# EAGLE design PiezoMini (EAGLE 7.5.0)
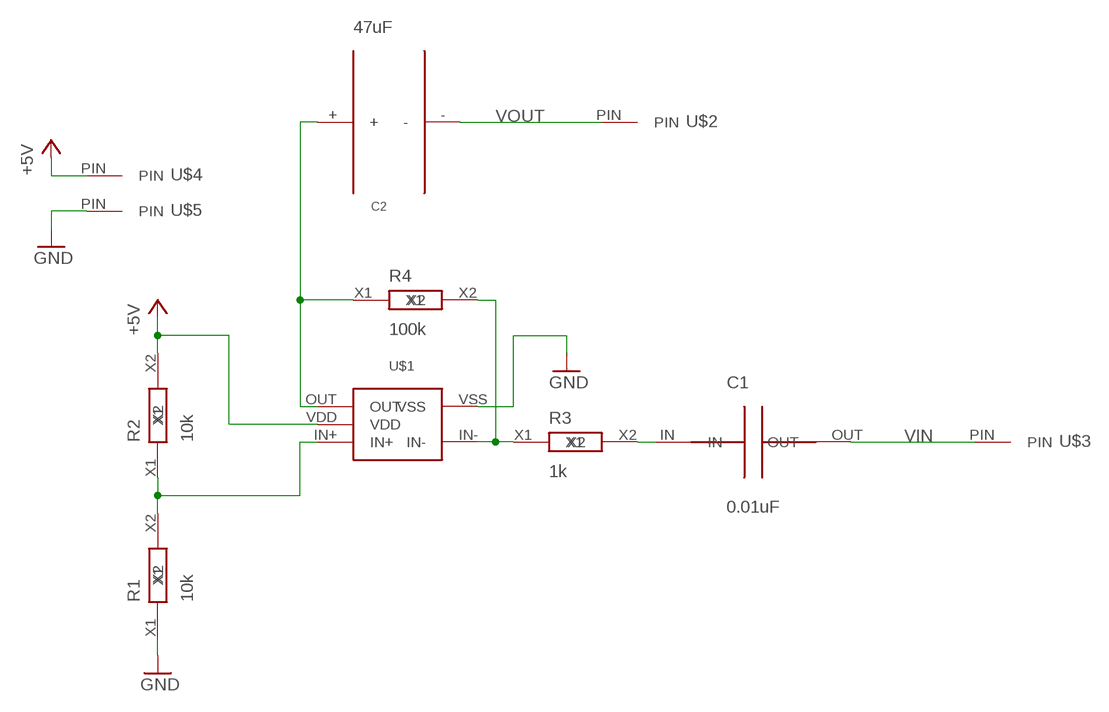
[diagram p0: schematic, sheet 1]

## Parts
C1  0.01uF  C_CER_5MM  [C_CER_5MM]
C2  47uF  C100UF  [C100UF]
R1  10k  R_SMD_2.1X1.25  [SMD_2.1X1.25]
R2  10k  R_SMD_2.1X1.25  [SMD_2.1X1.25]
R3  1k  R_SMD_2.1X1.25  [SMD_2.1X1.25]
R4  100k  R_SMD_2.1X1.25  [SMD_2.1X1.25]
U$1  MCP6L91  [MCP6L91]
U$2  PIN  [PIN]
U$3  PIN  [PIN]
U$4  PIN  [PIN]
U$5  PIN  [PIN]

## Nets
+5V: R2.X2 U$1.VDD U$4.PIN
GND: R1.X1 U$1.VSS U$5.PIN
N$1: R3.X1 R4.X2 U$1.IN-
N$2: C1.IN R3.X2
N$3: C2.+ R4.X1 U$1.OUT
N$4: R1.X2 R2.X1 U$1.IN+
VIN: C1.OUT U$3.PIN
VOUT: C2.- U$2.PIN

## Library data of the parts
C1 = MyDuino:C_CER_5MM
C2 = MyAmps:C100UF
R1-R4 = MyPowerComponents:R_SMD_2.1X1.25
U$1 = MyAmps:MCP6L91
U$2-U$5 = MySTM32F103RGT6:PIN

## Board
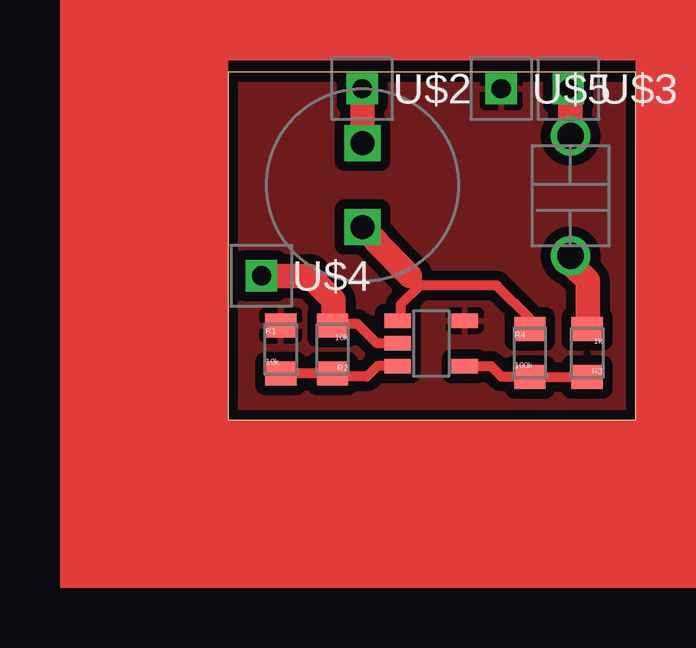
[diagram p1: board, top side]
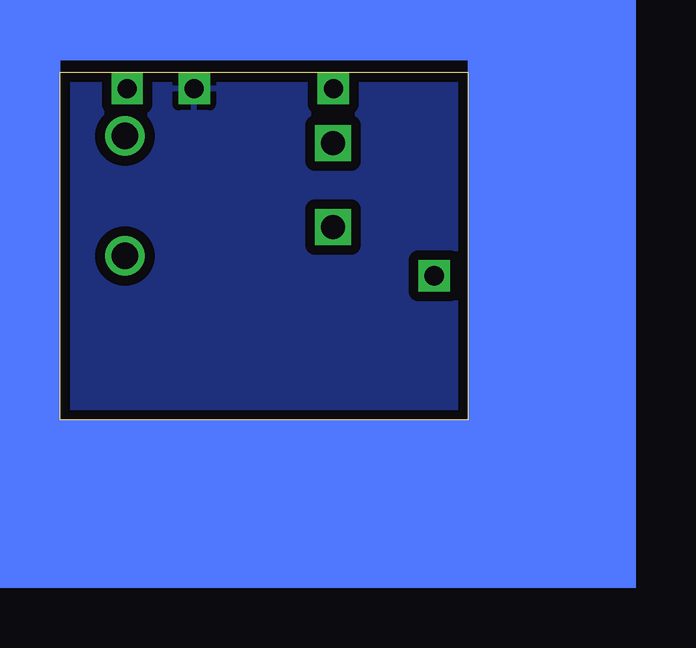
[diagram p2: board, bottom side, seen from below]

Size 17 x 14.5 mm. Coordinates in mm from the lower left corner, seen from the top.
Outline: 0,0 17,0 17,14.5 0,14.5 0,0
Copper layers (1*16): Top 0.035mm / dielectric 1.5mm / Bottom 0.035mm
Design rules "default *": minimum track width 10mil, minimum drill 24mil, track to track 8mil, track to pad 8mil, pad to pad 8mil, via to via 8mil, smd to smd 8mil, copper to edge 5mil, drill to drill 8mil, minimum pad ring 10mil, minimum via ring 8mil, stop-mask expansion 4mil, vias tented up to drill 0mil, thermal gap 10mil

### Footprints (pad centres in the part's own frame; a part is rotated, then mirrored left to right if it is on the bottom)
C_CER_5MM = drill 1.1: IN -2.5,0; OUT 2.5,0
C100UF = drill 1 square: + -1.75,0; - 1.75,0
SMD_2.1X1.25 = smd 1.3 x 1: X1 0,1; X2 0,-1
MCP6L91 = smd 1.1 x 0.6: IN+ -1.9,-0.95; IN- 0.9,-0.95; OUT -1.9,0.95; VDD -1.9,0; VSS 0.9,0.95
PIN = drill 0.8 square: PIN 0,0

### Placement (x,y rotation side)
C1  14.29,9.33 90 top
C2  5.62,9.78 90 top
R1  2.21,2.93 0 top
R2  4.37,2.93 180 top
R3  14.98,2.78 180 top
R4  12.59,2.78 0 top
U$1  8.98,3.18 0 top
U$2  5.6,13.8 0 top
U$3  14.2,13.8 0 top
U$4  1.4,6 0 top
U$5  11.4,13.8 0 top

### Tracks (layer width: path | path; a pad name or v marks a point on that pad's centre or on a via)
+5V
  Top 0.406: U$1.VDD 6.22,3.18 5.4,4 4.44,4 R2.X2
  Top 1.016: U$4.PIN 3.4,6 4.4,5 4.4,3.96 R2.X2
GND
  pour Top (isolate 0.406): 0,0 17,0 17,14.4 0,14.4
  pour Bottom (isolate 0.406): 0,0 17,0 17,14.4 0,14.4
N$1
  Top 0.406: U$1.IN- 10.97,2.23 11.4,1.8 12.57,1.8 R4.X2 R3.X1
N$2
  Top 1.016: C1.IN 14.29,6.51 15,5.8 15,3.8 R3.X2
N$3
  Top 0.406: R4.X1 12.59,4.21 11.2,5.6 8,5.6 | 8,5.6 7.2,4.8 7.2,4.25 U$1.OUT | 8,5.6 7.6,6
  Top 1.016: 7.6,6 6.2,7.4 6.2,7.45 C2.+
N$4
  Top 0.406: U$1.IN+ 6.23,2.23 5.8,1.8 4.5,1.8 R2.X1 R1.X2
VIN
  Top 1.016: C1.OUT 14.29,13.71 U$3.PIN
VOUT
  Top 1.016: C2.- 5.62,13.78 U$2.PIN
(copper drawn outside any net)
  shapes: Bottom area x6, Top area x4